# Altium schematic sheet Schematic1_1核心板.schdoc (part 1 of 3)
size 594 x 419 mm; Symbol: Drawing-Symbol_A4; Company: 嘉立创EDA; Version: V1.0; Page Size: A4; @Project Name: 短信息编辑器; @Update Date: 2026-06-04; @Create Date: 2026-06-04; Device: Drawing-Symbol_A4; @Board Name: Board1; @Page Name: P1; @Create Time: 14:51:12; @Page Count: 1; @Page No: 1; @Schematic Name: Schematic1; @Update Time: 14:51:12; @Assembly Variant: Basic; Border: 1; Title Block Position: 3; Size: A4; Width: 2338; Height: 1652; Region Start: 1; X Region Count: 6; Y Region Count: 4; Blade Width: 10
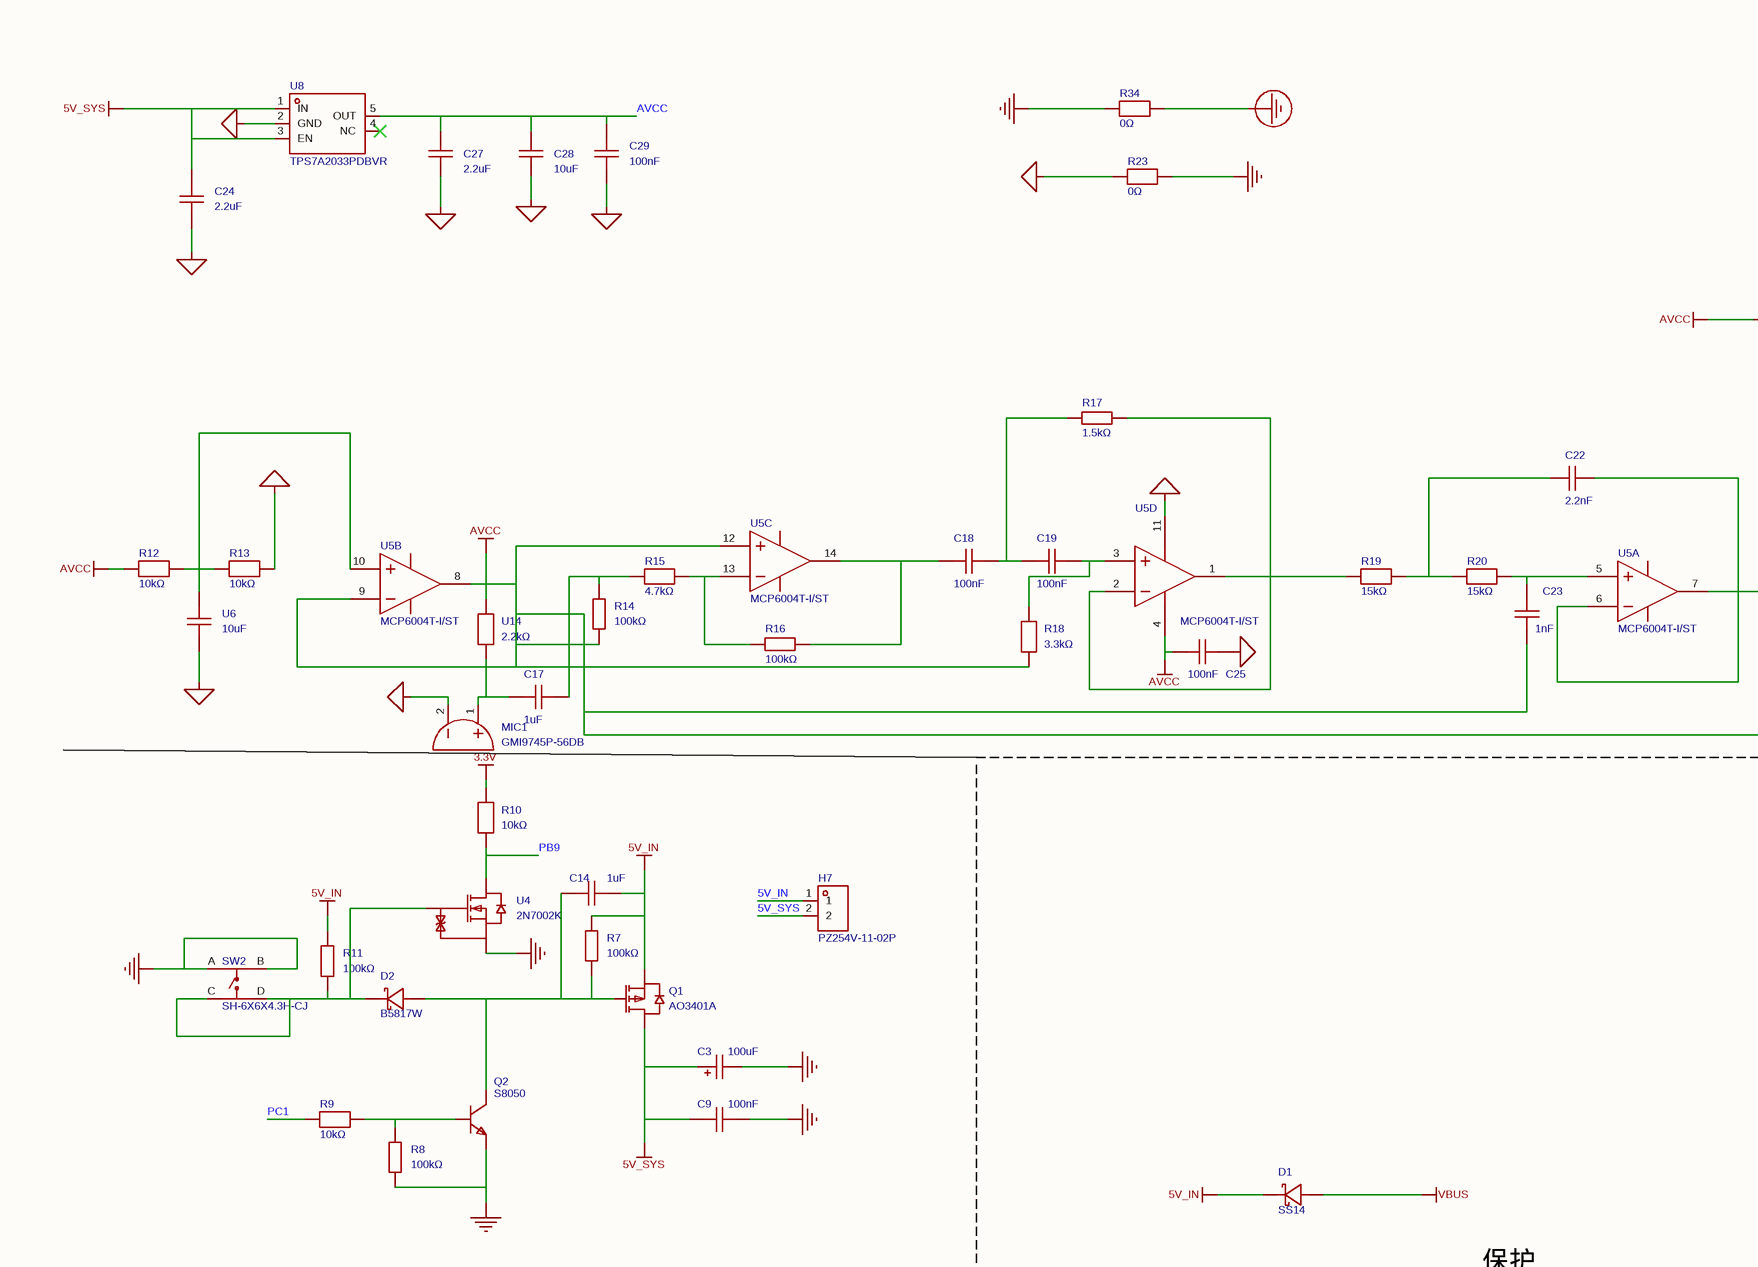
[diagram p0: Schematic1_1核心板.schdoc, top left]
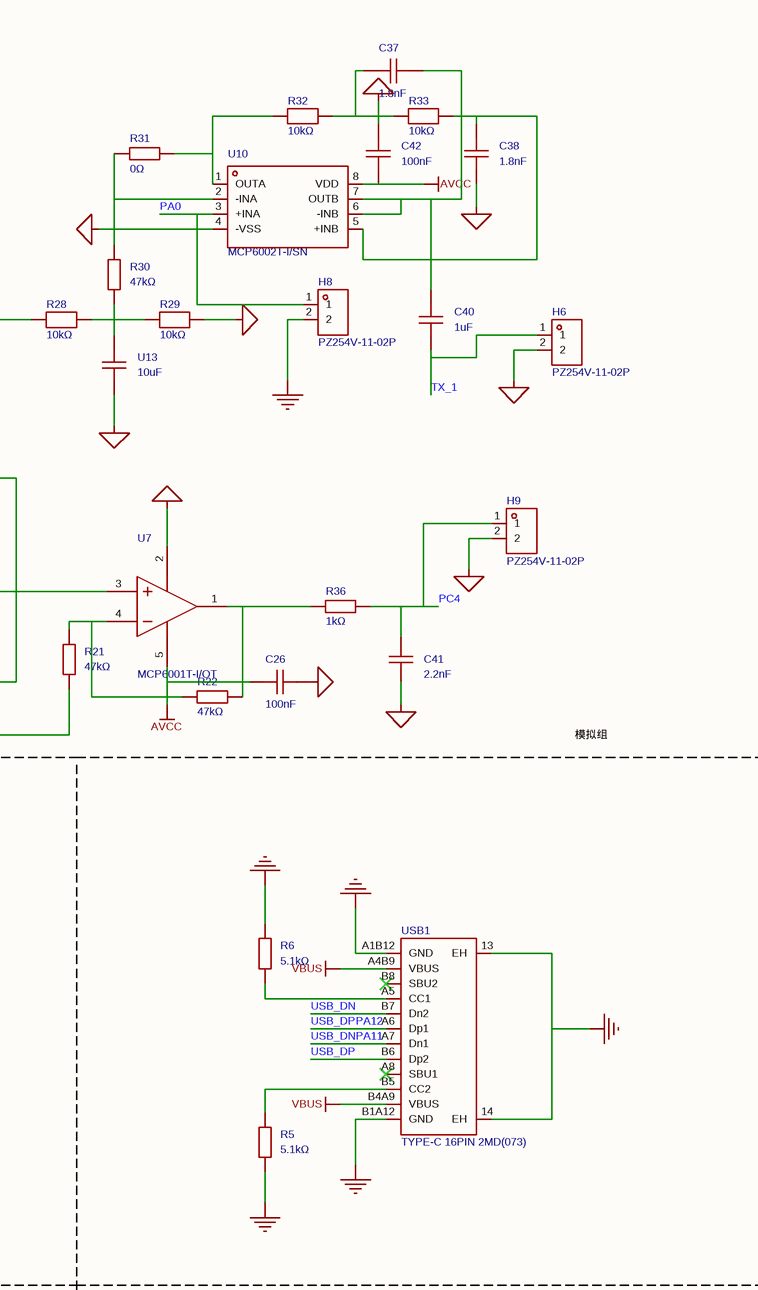
[diagram p1: Schematic1_1核心板.schdoc, top right]
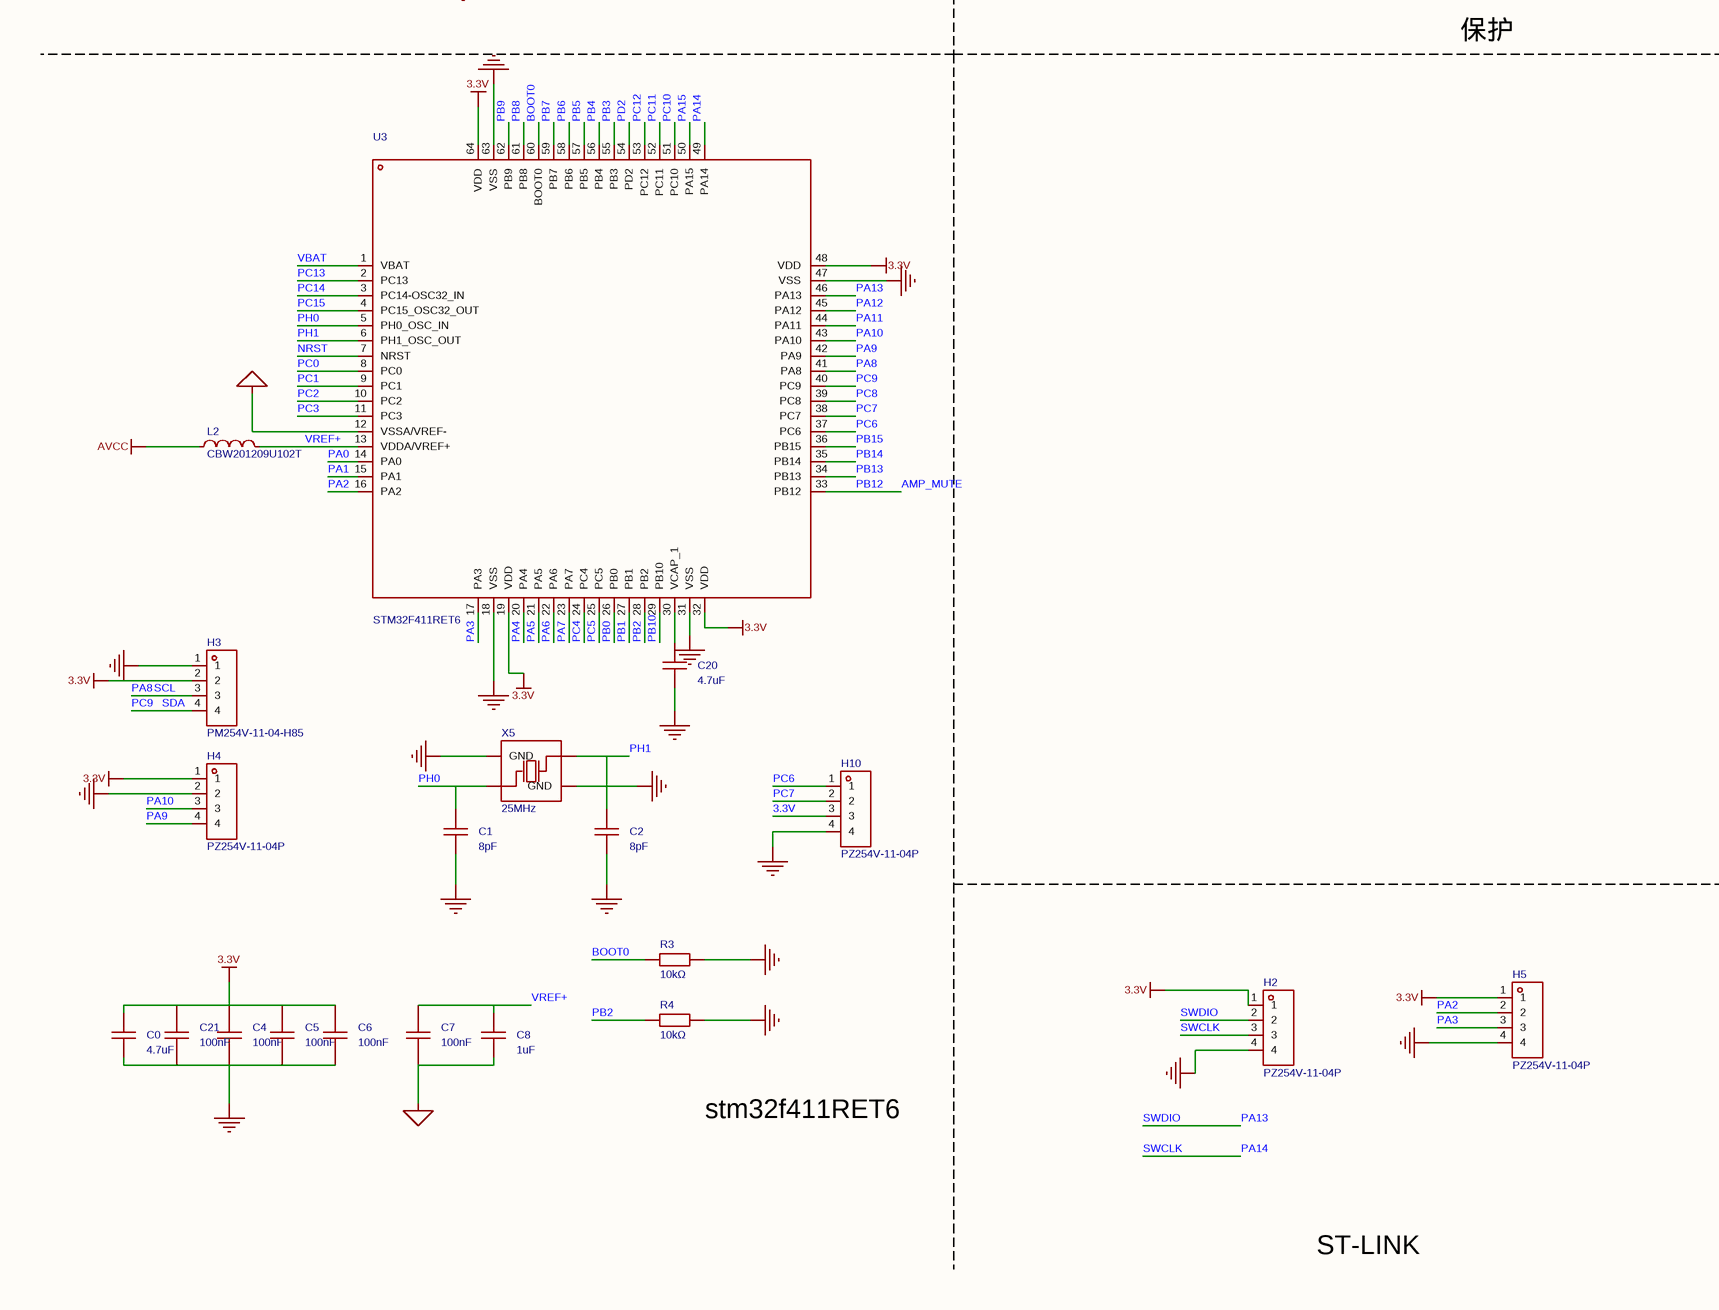
[diagram p2: Schematic1_1核心板.schdoc, bottom left]
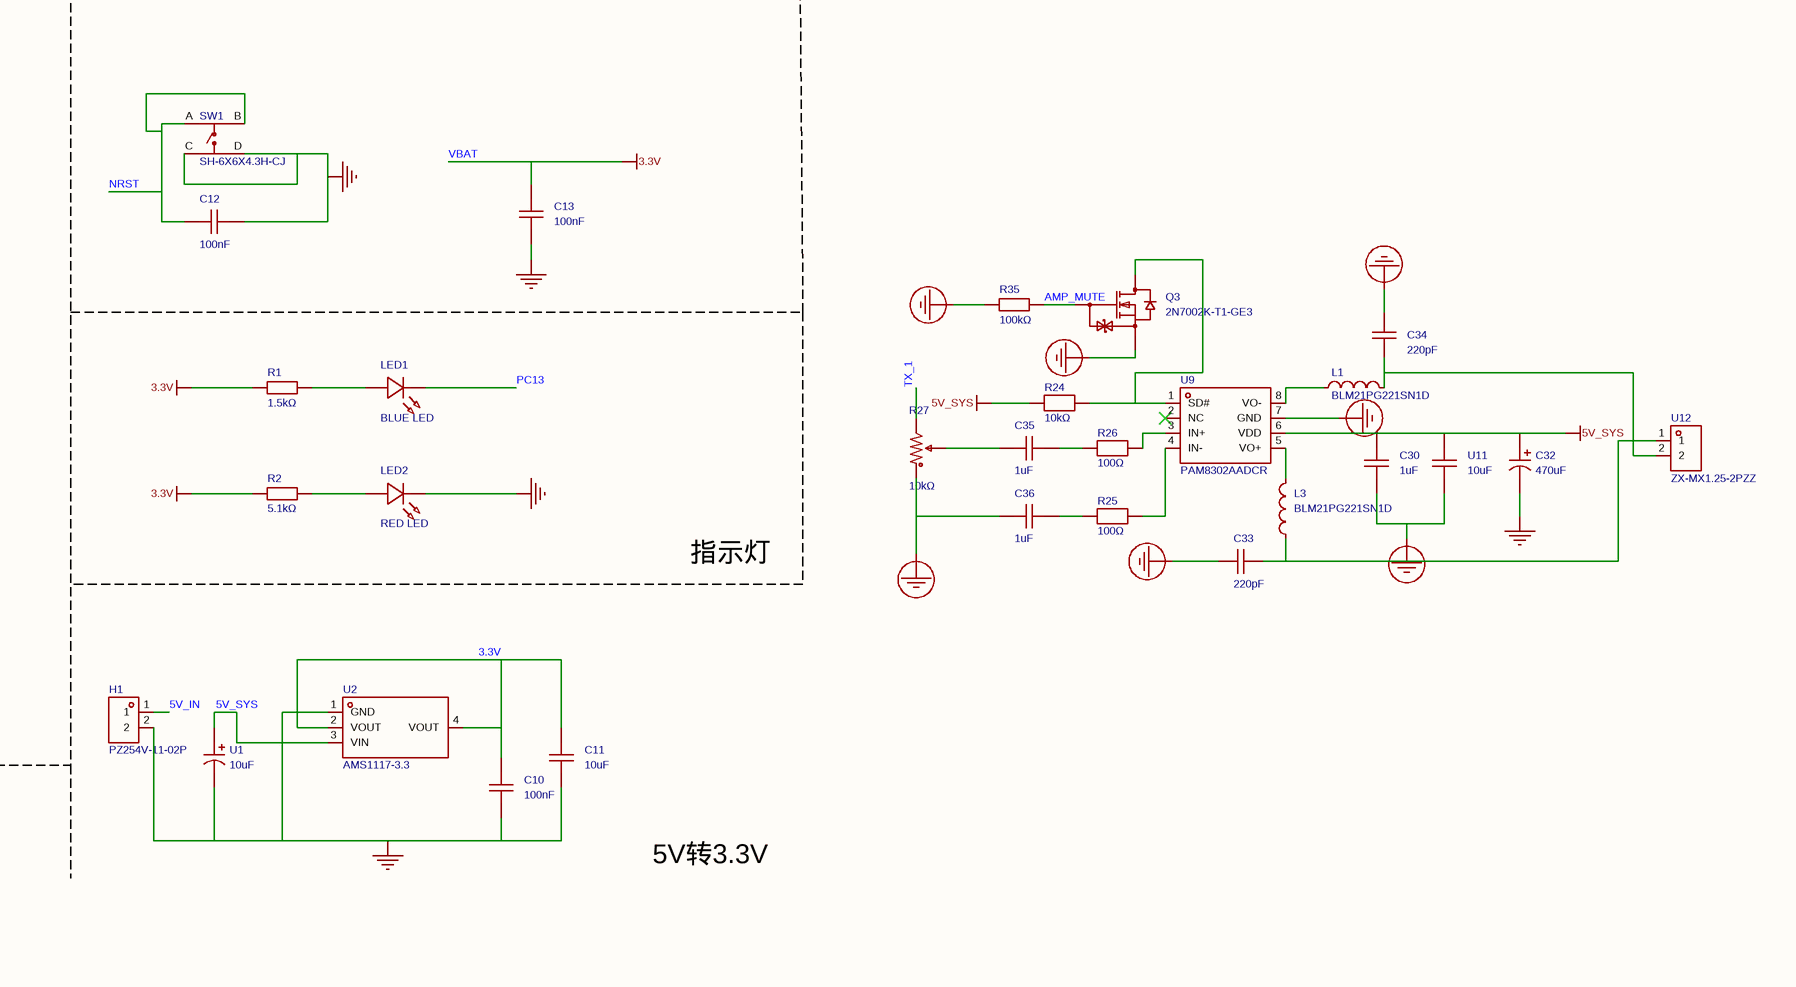
[diagram p3: Schematic1_1核心板.schdoc, bottom right]

## Parts
C0  4.7uF  [C0805]
C1  8pF  [C0603]
C2  8pF  [C0603]
C3  100uF  [CASE-B_3528]
C4  100nF  [C0805]
C5  100nF  [C0805]
C6  100nF  [C0805]
C7  100nF  [C0805]
C8  1uF  [C0805]
C9  100nF  [C0805]
C10  100nF  [C0805]
C11  10uF  [C0805]
C12  100nF  [C0805]
C13  100nF  [C0805]
C14  1uF  [C0805]
C17  1uF  [C0805]
C18  100nF  [C0805]
C19  100nF  [C0805]
C20  4.7uF  [C0805]
C21  100nF  [C0805]
C22  2.2nF  [C0805]
C23  1nF  [C0805]
C24  2.2uF  [C0805]
C25  100nF  [C0805]
C26  100nF  [C0805]
C27  2.2uF  [C0805]
C28  10uF  [C0805]
C29  100nF  [C0805]
C30  1uF  [C0805]
C32  470uF  [CAP-TH_BD10.0-P5.00-D0.6-FD]
C33  220pF  [C0805]
C34  220pF  [C0805]
C35  1uF  [C0805]
C36  1uF  [C0805]
C37  1.8nF  [C0805]
C38  1.8nF  [C0805]
C40  1uF  [C0805]
C41  2.2nF  [C0805]
C42  100nF  [C0805]
D1  SS14  [SMA_L4.3-W2.6-LS5.0-FD]
D2  B5817W  [SOD-123_L2.7-W1.6-LS3.7-FD]
H1  PZ254V-11-02P  [HDR-TH_2P-P2.54-V-M]
H2  PZ254V-11-04P  [HDR-TH_4P-P2.54-V-M]
H3  PM254V-11-04-H85  [HDR-TH_4P-P2.54-V-F]
H4  PZ254V-11-04P  [HDR-TH_4P-P2.54-V-M]
H5  PZ254V-11-04P  [HDR-TH_4P-P2.54-V-M]
H6  PZ254V-11-02P  [HDR-TH_2P-P2.54-V-M]
H7  PZ254V-11-02P  [HDR-TH_2P-P2.54-V-M]
H8  PZ254V-11-02P  [HDR-TH_2P-P2.54-V-M]
H9  PZ254V-11-02P  [HDR-TH_2P-P2.54-V-M]
H10  PZ254V-11-04P  [HDR-TH_4P-P2.54-V-M]
L1  BLM21PG221SN1D  [L0805]
L2  CBW201209U102T  [L0805]
L3  BLM21PG221SN1D  [L0805]
LED1  BLUE LED  [LED0805-RD_BLUE]
LED2  RED LED  [LED0805-R-RD_RED]
MIC1  GMI9745P-56DB  [MIC-TH_BD9.7-P2.54-D0.8-L-FD]
Q1  AO3401A  [SOT-23_L2.9-W1.3-P1.90-LS2.4-BR]
Q2  S8050  [SOT-23-3_L2.9-W1.3-P1.90-LS2.3-BR]
Q3  2N7002K-T1-GE3  [SOT-23-3_L2.9-W1.6-P1.90-LS2.8-BR]
R1  1.5kΩ  [R0805]
R2  5.1kΩ  [R0805]
R3  10kΩ  [R0805]
R4  10kΩ  [R0805]
R5  5.1kΩ  [R0805]
R6  5.1kΩ  [R0805]
R7  100kΩ  [R0805]
R8  100kΩ  [R0805]
R9  10kΩ  [R0805]
R10  10kΩ  [R0805]
R11  100kΩ  [R0805]
R12  10kΩ  [R0805]
R13  10kΩ  [R0805]
R14  100kΩ  [R0805]
R15  4.7kΩ  [R0805]
R16  100kΩ  [R0805]
R17  1.5kΩ  [R0805]
R18  3.3kΩ  [R0805]
R19  15kΩ  [R0805]
R20  15kΩ  [R0805]
R21  47kΩ  [R0805]
R22  47kΩ  [R0805]
R23  0Ω  [R0805]
R24  10kΩ  [R0805]
R25  100Ω  [R0805]
R26  100Ω  [R0805]
R27  10kΩ  [RES-ADJ-SMD_JER33X-1-14]
R28  10kΩ  [R0805]
R29  10kΩ  [R0805]
R30  47kΩ  [R0805]
R31  0Ω  [R0805]
R32  10kΩ  [R0805]
R33  10kΩ  [R0805]
R34  0Ω  [R0805]
R35  100kΩ  [R0805]
R36  1kΩ  [R0805]
SW1  SH-6X6X4.3H-CJ  [SW-TH_SH-6X6X4.3H-CJ]
SW2  SH-6X6X4.3H-CJ  [SW-TH_SH-6X6X4.3H-CJ]
U1  10uF  [CAP-SMD_L2.0-W1.3-FD]
U2  AMS1117-3.3  [SOT-223-3_L6.5-W3.4-P2.30-LS7.0-BR]
U3  STM32F411RET6  [LQFP-64_L10.0-W10.0-P0.50-LS12.0-BL]
U4  2N7002K  [SOT-23-3_L2.9-W1.3-P0.95-LS2.4-BR]
U5  MCP6004T-I/ST  [TSSOP-14_L5.0-W4.4-P0.65-LS6.4-BL]  (parts A,B,C,D of 4)
U6  10uF  [C0805]
U7  MCP6001T-I/OT  [SOT-23-5_L3.0-W1.7-P0.95-LS2.8-BR]
U8  TPS7A2033PDBVR  [SOT-23-5_L2.9-W1.6-P0.95-LS2.8-BR]
U9  PAM8302AADCR  [SOP-8_L4.9-W3.9-P1.27-LS6.0-BL]
U10  MCP6002T-I/SN  [SOIC-8_L4.9-W3.9-P1.27-LS6.0-BL]
U11  10uF  [C0805]
U12  ZX-MX1.25-2PZZ  [CONN-TH_2P-P1.25_MEGASTAR_ZX-MX1.25-2PZZ]
U13  10uF  [C0805]
U14  2.2kΩ  [R0805]
USB1  TYPE-C 16PIN 2MD(073)  [USB-C-SMD_TYPE-C-16PIN-2MD-073]
X5  25MHz  [CRYSTAL-SMD_4P-L3.2-W2.5-BL]

## Nets
3.3V: C0.2 C4.2 C5.2 C6.2 C10.2 C11.2 C13.2 C21.2 H2.1 H3.2 H4.1 H5.1 H10.3 R1.1 R2.1 R10.2 U2.2(VOUT) U2.4(VOUT) U3.1(VBAT) U3.19(VDD) U3.32(VDD) U3.48(VDD) U3.64(VDD)  [also labelled VBAT]
5V_IN: C14.1 D1.2(K) H1.1 H7.1 Q1.2(S) R7.2 R11.2
5V_SYS: C3.1 C9.2 C24.2 C30.2 C32.1 H7.2 Q1.3(D) R24.1 U1.1 U2.3(VIN) U8.1(IN) U8.3(EN) U9.6(VDD) U11.2
AGND: C7.1 C8.1 C24.1 C25.2 C26.2 C27.1 C28.1 C29.1 C38.2 C41.1 C42.2 H6.2 H9.2 MIC1.2 R13.2 R23.1 R29.2 U3.12(VSSA/VREF-) U5.11(VSS) U6.1 U7.2(VSS) U8.2(GND) U10.4(-VSS) U13.1
AVCC: C25.1 C26.1 C27.2 C28.2 C29.2 C42.1 L2.1 R12.1 R28.1 U5.4(VDD) U7.5(VDD) U8.5(OUT) U10.8(VDD) U14.2
GND: C0.1 C1.1 C2.1 C3.2 C4.1 C5.1 C6.1 C9.1 C10.1 C11.1 C12.1 C13.1 C20.1 C21.1 C32.2 H1.2 H2.4 H3.1 H4.2 H5.4 H8.2 H10.4 LED2.2(C) Q2.2(E) R3.2 R4.2 R5.1 R6.2 R8.1 R23.2 R34.1 SW1.C SW1.D SW2.A SW2.B U1.2 U2.1(GND) U3.18(VSS) U3.31(VSS) U3.47(VSS) U3.63(VSS) U4.2(S) USB1.13(EH) USB1.14(EH) USB1.A1B12(GND) USB1.B1A12(GND) X5.2(GND) X5.4(GND)
PGND: C30.1 C33.1 C34.2 C36.1 Q3.2(S) R27.1 R34.2 R35.1 U9.7(GND) U11.1
VBUS: D1.1(A) USB1.A4B9(VBUS) USB1.B4A9(VBUS)
AMP_MUTE: Q3.1(G) R35.2 U3.33(PB12)  [also labelled PB12]
BOOT0: R3.1 U3.60(BOOT0)
NRST: C12.2 SW1.A SW1.B U3.7(NRST)
PA0: H8.1 U3.14(PA0) U10.3(+INA)
PA1: U3.15(PA1)
PA2: H5.2 U3.16(PA2)
PA3: H5.3 U3.17(PA3)
PA4: U3.20(PA4)
PA5: U3.21(PA5)
PA6: U3.22(PA6)
PA7: U3.23(PA7)
PA8: H3.3 U3.41(PA8)  [also labelled SCL]
PA9: H4.4 U3.42(PA9)
PA10: H4.3 U3.43(PA10)
PA11: U3.44(PA11) USB1.A7(Dn1) USB1.B7(Dn2)  [also labelled USB_DN]
PA12: U3.45(PA12) USB1.A6(Dp1) USB1.B6(Dp2)  [also labelled USB_DP]
PA13: H2.2 U3.46(PA13)  [also labelled SWDIO]
PA14: H2.3 U3.49(PA14)  [also labelled SWCLK]
PA15: U3.50(PA15)
PB0: U3.26(PB0)
PB1: U3.27(PB1)
PB2: R4.1 U3.28(PB2)
PB3: U3.55(PB3)
PB4: U3.56(PB4)
PB5: U3.57(PB5)
PB6: U3.58(PB6)
PB7: U3.59(PB7)
PB8: U3.61(PB8)
PB9: R10.1 U3.62(PB9) U4.3(D)
PB10: U3.29(PB10)
PB13: U3.34(PB13)
PB14: U3.35(PB14)
PB15: U3.36(PB15)
PC0: U3.8(PC0)
PC1: R9.1 U3.9(PC1)
PC2: U3.10(PC2)
PC3: U3.11(PC3)
PC4: C41.2 H9.1 R36.2 U3.24(PC4)
PC5: U3.25(PC5)
PC6: H10.1 U3.37(PC6)
PC7: H10.2 U3.38(PC7)
PC8: U3.39(PC8)
PC9: H3.4 U3.40(PC9)  [also labelled SDA]
PC10: U3.51(PC10)
PC11: U3.52(PC11)
PC12: U3.53(PC12)
PC13: LED1.1(K) U3.2(PC13)
PC14: U3.3(PC14-OSC32_IN)
PC15: U3.4(PC15_OSC32_OUT)
PD2: U3.54(PD2)
PH0: C1.2 U3.5(PH0_OSC_IN) X5.1(OSC1)
PH1: C2.2 U3.6(PH1_OSC_OUT) X5.3(OSC2)
TX_1: C40.1 H6.1 R27.3
VREF+: C7.2 C8.2 L2.2 U3.13(VDDA/VREF+)
NetC14_2: C14.2 D2.1(A) Q1.1(G) Q2.3(C) R7.1
NetC17_1: C17.1 MIC1.1 U14.1
NetC17_2: C17.2 R14.2 R15.1
NetC18_1: C18.1 R16.1 U5.14(VOUTD)
NetC18_2: C18.2 C19.1 R17.1
NetC19_2: C19.2 R18.2 U5.3(VINA+)
NetC20_2: C20.2 U3.30(VCAP_1)
NetC22_1: C22.1 R19.2 R20.1
NetC22_2: C22.2 U5.6(VINB-) U5.7(VOUTB) U7.3(VIN+)
NetC23_1: C23.1 R14.1 R18.1 R21.1 U5.8(VOUTC) U5.9(VINC-) U5.12(VIND+)
NetC23_2: C23.2 R20.2 U5.5(VINB+)
NetC33_2: C33.2 L3.1 U12.1
NetC34_1: C34.1 L1.2 U12.2
NetC35_1: C35.1 R27.2
NetC35_2: C35.2 R26.1
NetC36_2: C36.2 R25.1
NetC37_1: C37.1 C40.2 U10.6(-INB) U10.7(OUTB)
NetC37_2: C37.2 R32.2 R33.1
NetC38_1: C38.1 R33.2 U10.5(+INB)
NetD2_2: D2.2(K) R11.1 SW2.C SW2.D U4.1(G)
NetL1_1: L1.1 U9.8(VO-)
NetL3_2: L3.2 U9.5(VO+)
NetLED1_2: LED1.2(A) R1.2
NetLED2_1: LED2.1(A) R2.2
NetQ2_1: Q2.1(B) R8.2 R9.2
NetQ3_3: Q3.3(D) R24.2 U9.1(SD#)
NetR5_2: R5.2 USB1.B5(CC2)
NetR6_1: R6.1 USB1.A5(CC1)
NetR12_2: R12.2 R13.1 U5.10(VINC+) U6.2
NetR15_2: R15.2 R16.2 U5.13(VIND-)
NetR17_2: R17.2 R19.1 U5.1(VOUTA) U5.2(VINA-)
NetR21_2: R21.2 R22.2 U7.4(VIN-)
NetR22_1: R22.1 R36.1 U7.1(VOUT)
NetR25_2: R25.2 U9.4(IN-)
NetR26_2: R26.2 U9.3(IN+)
NetR28_2: R28.2 R29.1 R30.1 U13.2
NetR30_2: R30.2 R31.2 U10.2(-INA)
NetR31_1: R31.1 R32.1 U10.1(OUTA)

Not connected (* = marked no-connect by the designer): U8 4(NC)*; U9 2(NC)*; USB1 A8(SBU1)* B8(SBU2)*

## Notes on the sheet
- 模拟组
- 保护
- 指示灯
- 5V转3.3V
- stm32f411RET6
- ST-LINK
- 创建日期
- 2026-06-04
- 原理图
- 板子
- Schematic1
- Board1
- 更新日期
- 图页
- P1
- 绘制
- 审阅
- 短信息编辑器
- 版本
- V1.0
- 尺寸
- A4
- 页    1    共    1
- 嘉立创EDA